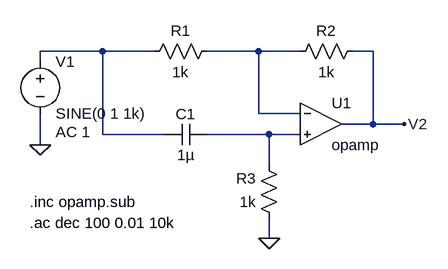
[diagram p0: schematic TS1.asc]
TS1.asc, the LTspice schematic file:
Version 4
SHEET 1 880 680
WIRE 64 128 -32 128
WIRE 144 128 64 128
WIRE 304 128 224 128
WIRE 368 128 304 128
WIRE 480 128 448 128
WIRE -32 144 -32 128
WIRE 304 224 304 128
WIRE 368 224 304 224
WIRE 480 240 480 128
WIRE 480 240 432 240
WIRE 528 240 480 240
WIRE 64 256 64 128
WIRE 160 256 64 256
WIRE 320 256 224 256
WIRE 368 256 320 256
WIRE -32 272 -32 224
WIRE 320 304 320 256
WIRE 320 416 320 384
FLAG -32 272 0
FLAG 320 416 0
FLAG 528 240 V2
SYMBOL res 240 112 R90
WINDOW 0 0 56 VBottom 2
WINDOW 3 32 56 VTop 2
SYMATTR InstName R1
SYMATTR Value 1k
SYMBOL res 464 112 R90
WINDOW 0 0 56 VBottom 2
WINDOW 3 32 56 VTop 2
SYMATTR InstName R2
SYMATTR Value 1k
SYMBOL res 336 400 R180
WINDOW 0 36 76 Left 2
WINDOW 3 36 40 Left 2
SYMATTR InstName R3
SYMATTR Value 1k
SYMBOL cap 224 240 R90
WINDOW 0 0 32 VBottom 2
WINDOW 3 32 32 VTop 2
SYMATTR InstName C1
SYMATTR Value 1µ
SYMBOL voltage -32 128 R0
WINDOW 123 24 124 Left 2
WINDOW 39 0 0 Left 0
SYMATTR Value2 AC 1
SYMATTR InstName V1
SYMATTR Value SINE(0 1 1k)
SYMBOL OpAmps\\opamp 400 176 R0
SYMATTR InstName U1
TEXT -48 360 Left 2 !.inc opamp.sub
TEXT -48 392 Left 2 !.ac dec 100 0.01 10k

The netlist it stands for:
* TS1.asc
R1 N002 N001 1k
R2 V2 N002 1k
R3 0 N003 1k
C1 N003 N001 1µ
V1 N001 0 SINE(0 1 1k) AC 1
XU1 N002 N003 V2 opamp Aol=100K GBW=10Meg  ; pins invin noninvin out
.inc opamp.sub
.ac dec 100 0.01 10k
.backanno
.end